# Altium schematic sheet Periph.SchDoc
size A3; DocumentNumber: 3; SheetNumber: 3; SheetTotal: 7
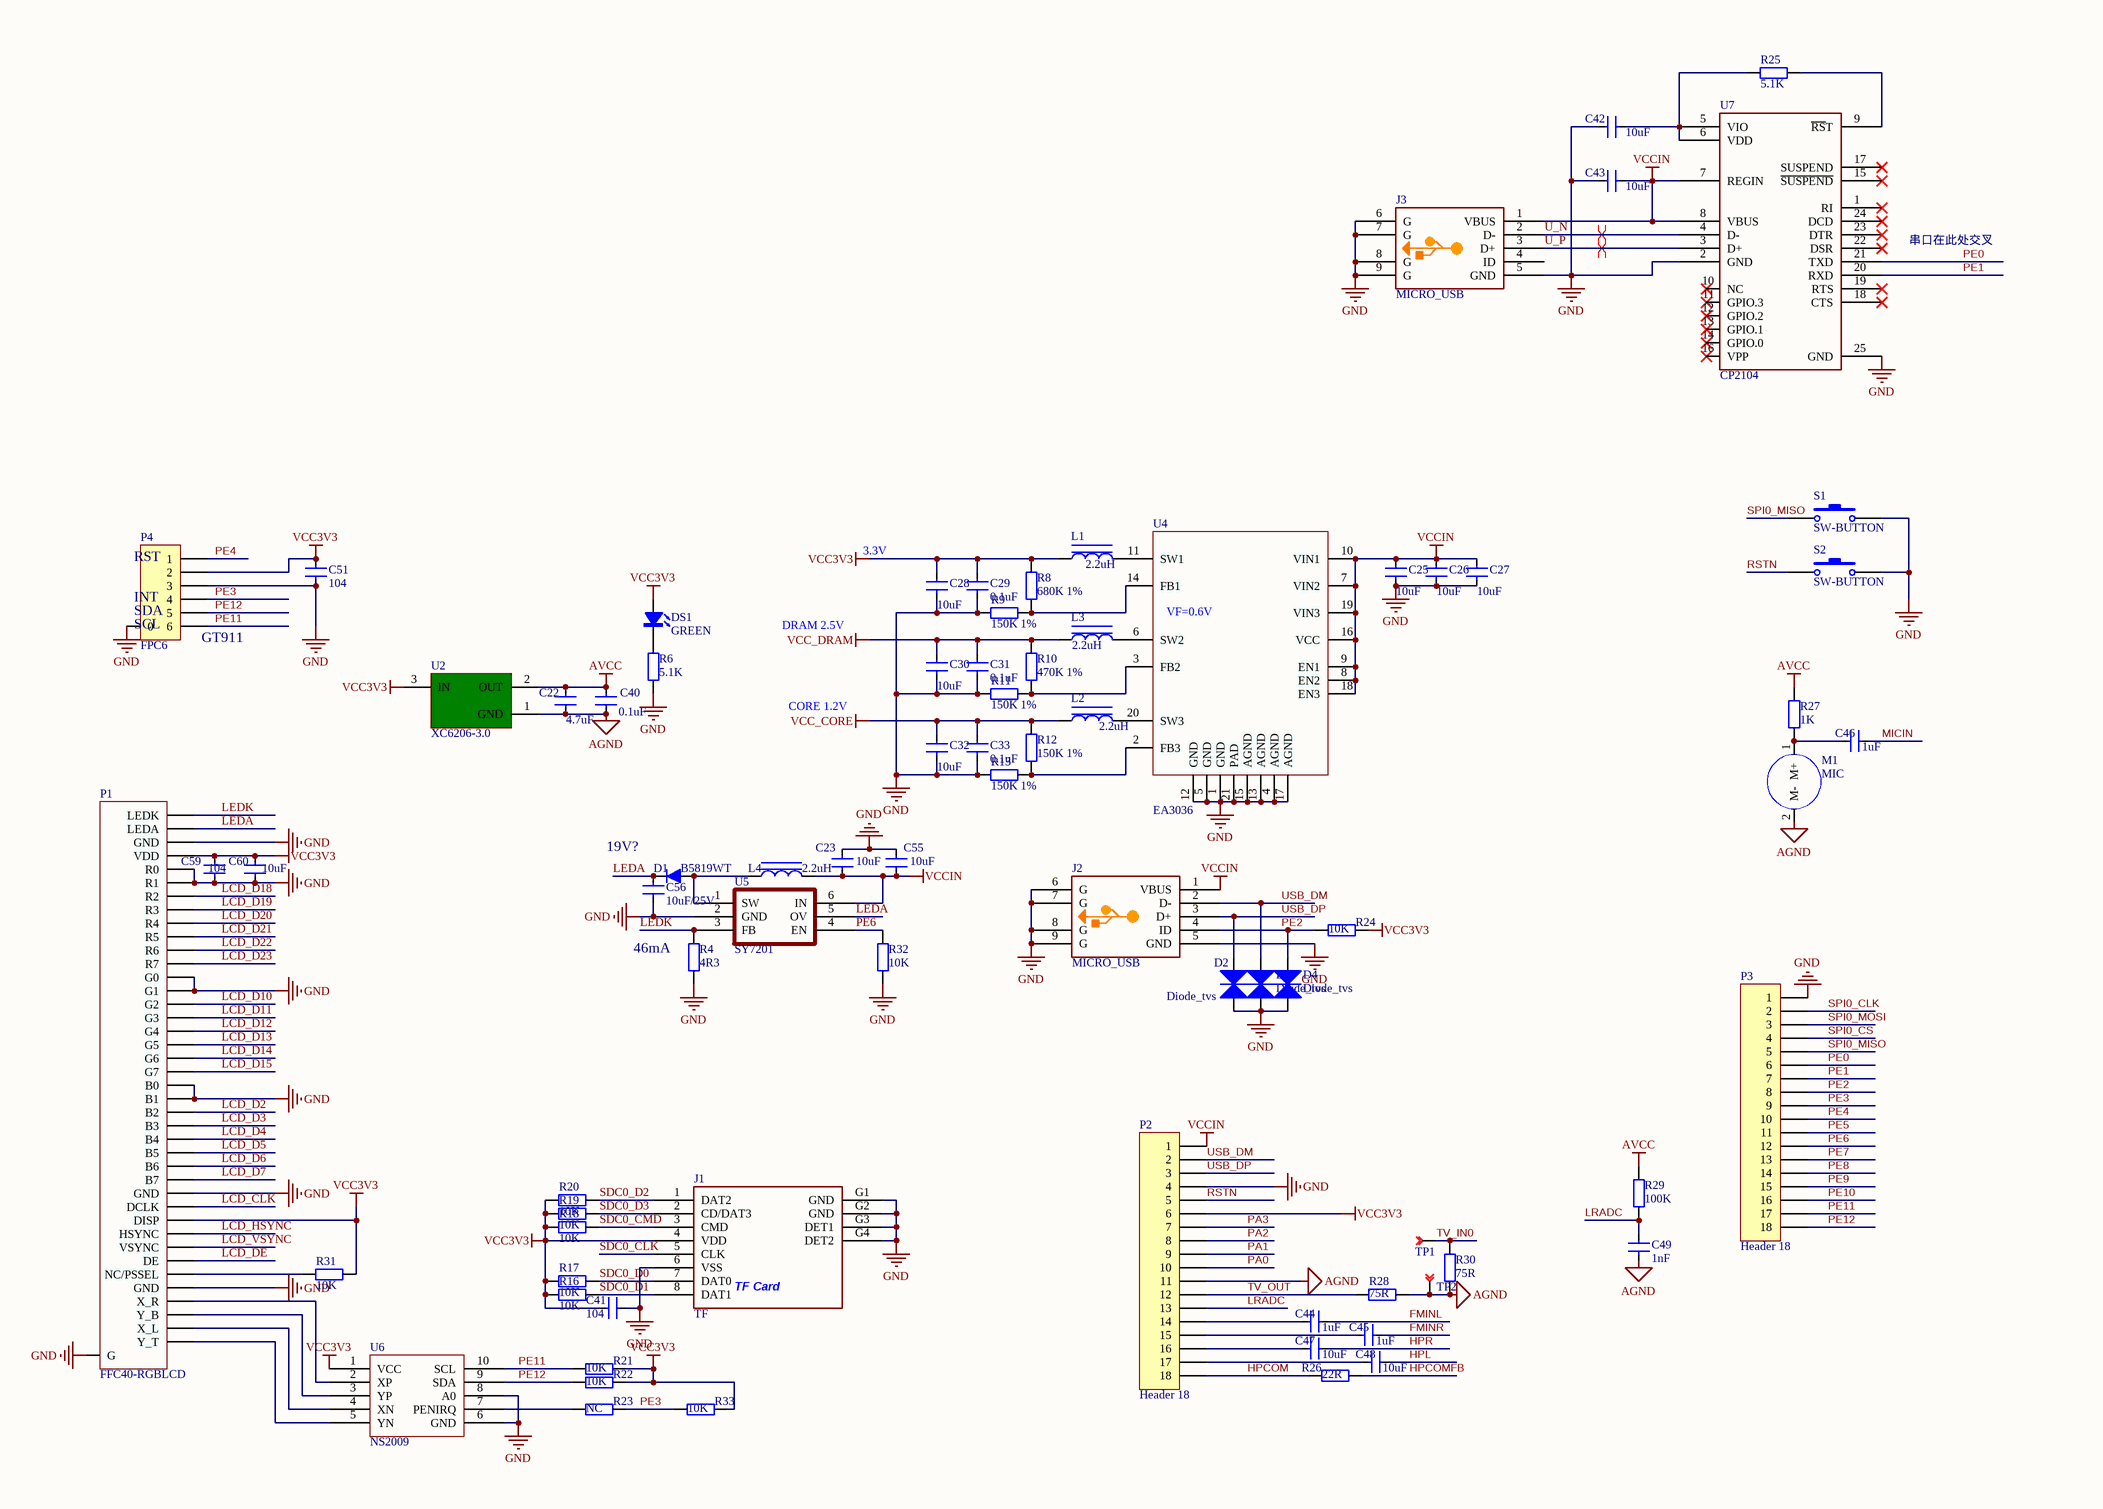
[diagram p0: Periph.SchDoc]

## Parts
C22  4.7uF  [C0402]
C23  10uF  [C0402]
C25  10uF  [C0402]
C26  10uF  [C0402]
C27  10uF  [C0402]
C28  10uF  [C0402]
C29  0.1uF  [C0402]
C30  10uF  [C0402]
C31  0.1uF  [C0402]
C32  10uF  [C0402]
C33  0.1uF  [C0402]
C40  0.1uF  [C0402]
C41  104  [C0402]
C42  10uF  [C0402]
C43  10uF  [C0402]
C44  1uF  [C0402]
C45  1uF  [C0402]
C46  1uF  [C0402]
C47  10uF  [C0402]
C48  10uF  [C0402]
C49  1nF  [C0402]
C51  104  [C0402]
C55  10uF  [C0402]
C56  10uF/25V  [C0603]
C59  104  [C0402]
C60  10uF  [C0402]
D1  B5819WT  [SOD523]
D2  Diode_tvs  [0402TVS]
D3  Diode_tvs  [0402TVS]
D4  Diode_tvs  [0402TVS]
DS1  GREEN  [LED0402]
J1  TF  [TFCARD473092651]
J2  MICRO_USB  [MICROUSB]
J3  MICRO_USB  [MICROUSB]
L1  2.2uH  [VLS2016]
L2  2.2uH  [VLS2016]
L3  2.2uH  [VLS2016]
L4  2.2uH  [VLS3012E]
M1  MIC  [MIC]
P1  FFC40-RGBLCD  [FFC/SM0.5-1H40]
P2  Header 18  [HDR1X18-M2]
P3  Header 18  [HDR1X18-M2]
P4  FPC6  [FPC6]
R4  4R3  [R0402]
R6  5.1K  [R0402]
R8  680K 1%  [R0402]
R9  150K 1%  [R0402]
R10  470K 1%  [R0402]
R11  150K 1%  [R0402]
R12  150K 1%  [R0402]
R13  150K 1%  [R0402]
R16  10K  [R0402]
R17  10K  [R0402]
R18  10K  [R0402]
R19  10K  [R0402]
R20  10K  [R0402]
R21  10K  [R0402]
R22  10K  [R0402]
R23  NC  [R0402]
R24  10K  [R0402]
R25  5.1K  [R0402]
R26  22R  [R0402]
R27  1K  [R0402]
R28  75R  [R0402]
R29  100K  [R0402]
R30  75R  [R0402]
R31  10K  [R0402]
R32  10K  [R0402]
R33  10K  [R0402]
S1  SW-BUTTON  [MINIBUTTON]
S2  SW-BUTTON  [MINIBUTTON]
TP1  TEST POINT  [TEST-POINT]  (value not drawn)
TP2  TEST POINT  [TEST-POINT]  (value not drawn)
U2  XC6206-3.0  [SOT23]
U4  EA3036  [QFN40P300X300X80_HS-21N]
U5  SY7201  [SOT23-6]
U6  NS2009  [TSSOP10]
U7  CP2104  [QFN24]

## Nets
AGND: C22.1 C40.1 C49.1 M1.2(M-) P2.11 R28.2 R30.2 TP2.1 U2.1(GND)
AVCC: C22.2 C40.2 R27.1 R29.2 U2.2(OUT)
GND: C23.2 C25.2 C26.2 C27.2 C28.2 C29.1 C30.2 C31.1 C32.2 C33.1 C41.2 C42.2 C43.1 C51.1 C55.1 C56.1 C59.2 C60.1 D2.2 D3.1 D4.1 J1.6(VSS) J1.G1(GND) J1.G2(GND) J1.G3(DET1) J1.G4(DET2) J2.5(GND) J2.6(G) J2.7(G) J2.8(G) J2.9(G) J3.5(GND) J3.6(G) J3.7(G) J3.8(G) J3.9(G) P1.3(GND) P1.5(R0) P1.6(R1) P1.13(G0) P1.14(G1) P1.21(B0) P1.22(B1) P1.29(GND) P1.36(GND) P1.G P2.4 P3.1 P4.0 P4.3 R4.1 R6.2 R9.2 R11.2 R13.2 R32.2 S1.2 S2.2 U4.1(GND) U4.4(AGND) U4.5(GND) U4.12(GND) U4.13(AGND) U4.15(AGND) U4.17(AGND) U4.21(PAD) U5.2(GND) U6.6(GND) U6.8(A0) U7.2(GND) U7.25(GND)
VCC3V3: C28.1 C29.2 C41.1 C51.2 C59.1 C60.2 DS1.A J1.4(VDD) L1.2 P1.4(VDD) P1.31(DISP) P2.6 P4.2 R8.1 R16.1 R17.1 R18.1 R19.1 R20.1 R21.2 R22.2 R24.2 R31.1 R33.2 U2.3(IN) U6.1(VCC)
VCC_CORE: C32.1 C33.2 L2.2 R12.1
VCC_DRAM: C30.1 C31.2 L3.2 R10.1
VCCIN: C23.1 C25.1 C26.1 C27.1 C43.2 C55.2 J2.1(VBUS) J3.1(VBUS) L4.1 P2.1 U4.7(VIN2) U4.8(EN2) U4.9(EN1) U4.10(VIN1) U4.16(VCC) U4.18(EN3) U4.19(VIN3) U5.6(IN) U7.7(REGIN) U7.8(VBUS)
FMINL: C44.2
FMINR: C45.2
HPCOM: P2.18 R26.1
HPCOMFB: R26.2
HPL: C48.2
HPR: C47.2
LCD_CLK: P1.30(DCLK)
LCD_D2: P1.23(B2)
LCD_D3: P1.24(B3)
LCD_D4: P1.25(B4)
LCD_D5: P1.26(B5)
LCD_D6: P1.27(B6)
LCD_D7: P1.28(B7)
LCD_D10: P1.15(G2)
LCD_D11: P1.16(G3)
LCD_D12: P1.17(G4)
LCD_D13: P1.18(G5)
LCD_D14: P1.19(G6)
LCD_D15: P1.20(G7)
LCD_D18: P1.7(R2)
LCD_D19: P1.8(R3)
LCD_D20: P1.9(R4)
LCD_D21: P1.10(R5)
LCD_D22: P1.11(R6)
LCD_D23: P1.12(R7)
LCD_DE: P1.34(DE)
LCD_HSYNC: P1.32(HSYNC)
LCD_VSYNC: P1.33(VSYNC)
LEDA: C56.2 D1.K P1.2(LEDA) U5.5(OV)
LEDK: P1.1(LEDK) R4.2 U5.3(FB)
LRADC: C49.2 P2.13 R29.1
MICIN: C46.2
PA0: P2.10
PA1: P2.9
PA2: P2.8
PA3: P2.7
PE0: P3.6 U7.21(TXD)
PE1: P3.7 U7.20(RXD)
PE2: D4.2 J2.4(ID) P3.8 R24.1
PE3: P3.9 P4.4 R23.2 R33.1
PE4: P3.10 P4.1
PE5: P3.11
PE6: P3.12 R32.1 U5.4(EN)
PE7: P3.13
PE8: P3.14
PE9: P3.15
PE10: P3.16
PE11: P3.17 P4.6 R21.1 U6.10(SCL)
PE12: P3.18 P4.5 R22.1 U6.9(SDA)
RSTN: P2.5 S2.1
SDC0_CLK: J1.5(CLK)
SDC0_CMD: J1.3(CMD) R18.2
SDC0_D0: J1.7(DAT0) R17.2
SDC0_D1: J1.8(DAT1) R16.2
SDC0_D2: J1.1(DAT2) R20.2
SDC0_D3: J1.2(CD/DAT3) R19.2
SPI0_CLK: P3.2
SPI0_CS: P3.4
SPI0_MISO: P3.5 S1.1
SPI0_MOSI: P3.3
TV_IN0: R30.1 TP1.1
TV_OUT: P2.12 R28.1
U_N: J3.2(D-) U7.4(D-)
U_P: J3.3(D+) U7.3(D+)
USB_DM: D3.2 J2.2(D-) P2.2
USB_DP: D2.1 J2.3(D+) P2.3
NetC42_1: C42.1 R25.1 U7.5(VIO) U7.6(VDD)
NetC44_1: C44.1 P2.14
NetC45_1: C45.1 P2.15
NetC46_1: C46.1 M1.1(M+) R27.2
NetC47_1: C47.1 P2.16
NetC48_1: C48.1 P2.17
NetD1_A: D1.A L4.2 U5.1(SW)
NetDS1_K: DS1.K R6.1
NetL1_1: L1.1 U4.11(SW1)
NetL2_1: L2.1 U4.20(SW3)
NetL3_1: L3.1 U4.6(SW2)
NetP1_35: P1.35(NC/PSSEL) R31.2
NetP1_37: P1.37(X_R) U6.2(XP)
NetP1_38: P1.38(Y_B) U6.3(YP)
NetP1_39: P1.39(X_L) U6.4(XN)
NetP1_40: P1.40(Y_T) U6.5(YN)
NetR8_2: R8.2 R9.1 U4.14(FB1)
NetR10_2: R10.2 R11.1 U4.3(FB2)
NetR12_2: R12.2 R13.1 U4.2(FB3)
NetR23_1: R23.1 U6.7(PENIRQ)
NetR25_2: R25.2 U7.9(~{RS}T)

Not connected (* = marked no-connect by the designer): J3 4(ID); U7 1(RI)* 10(NC)* 11(GPIO.3)* 12(GPIO.2)* 13(GPIO.1)* 14(GPIO.0)* 15(~{SUSPEND})* 16(VPP)* 17(SUSPEND)* 18(CTS)* 19(RTS)* 22(DSR)* 23(DTR)* 24(DCD)*

## Layout directives
differential pair: U_N, U_P

## Notes on the sheet
- 串口在此处交叉
- (near P4) RST
- (near C28) 3.3V
- (near P4) SDA
- (near P4) SCL
- (near P4) INT
- (near P4) GT911
- DRAM 2.5V
- (near U4) VF=0.6V
- CORE 1.2V
- 19V?
- 46mA
- (in symbol TF_473092651) TF Card

## Library data of the parts
C22 C23 C25-C33 C40-C49 C51 C55 C56 C59 C60 = CAP: 普通小电容
D1 = Diode: 普通二极管
D2-D4 = Diode_tvs: tvs
DS1 = LED
J1 = TF_473092651
L1-L4 = L: 普通电感
P2 P3 = Header 18: Header, 18-Pin; LatestRevisionDate: 17-Jul-2002; LatestRevisionNote: Re-released for DXP Platform.; Publisher: Altium Limited
R4 R8-R13 R16-R33 = RES: 普通电阻
R6 = RES: 普通电阻1%精度
TP1 TP2 = TP: Description
U2 = XC6206
U5 = PT4101
P1 = FFC40-RGBLCD: LatestRevisionDate: 17-Jul-2002; LatestRevisionNote: Re-released for DXP Platform.; Publisher: Altium Limited
P4 = FPC6: LatestRevisionDate: 17-Jul-2002; LatestRevisionNote: Re-released for DXP Platform.; Publisher: Altium Limited